# EAGLE schematic MySens-GWeasySensRS485-V01-009 (EAGLE 7.6.0)
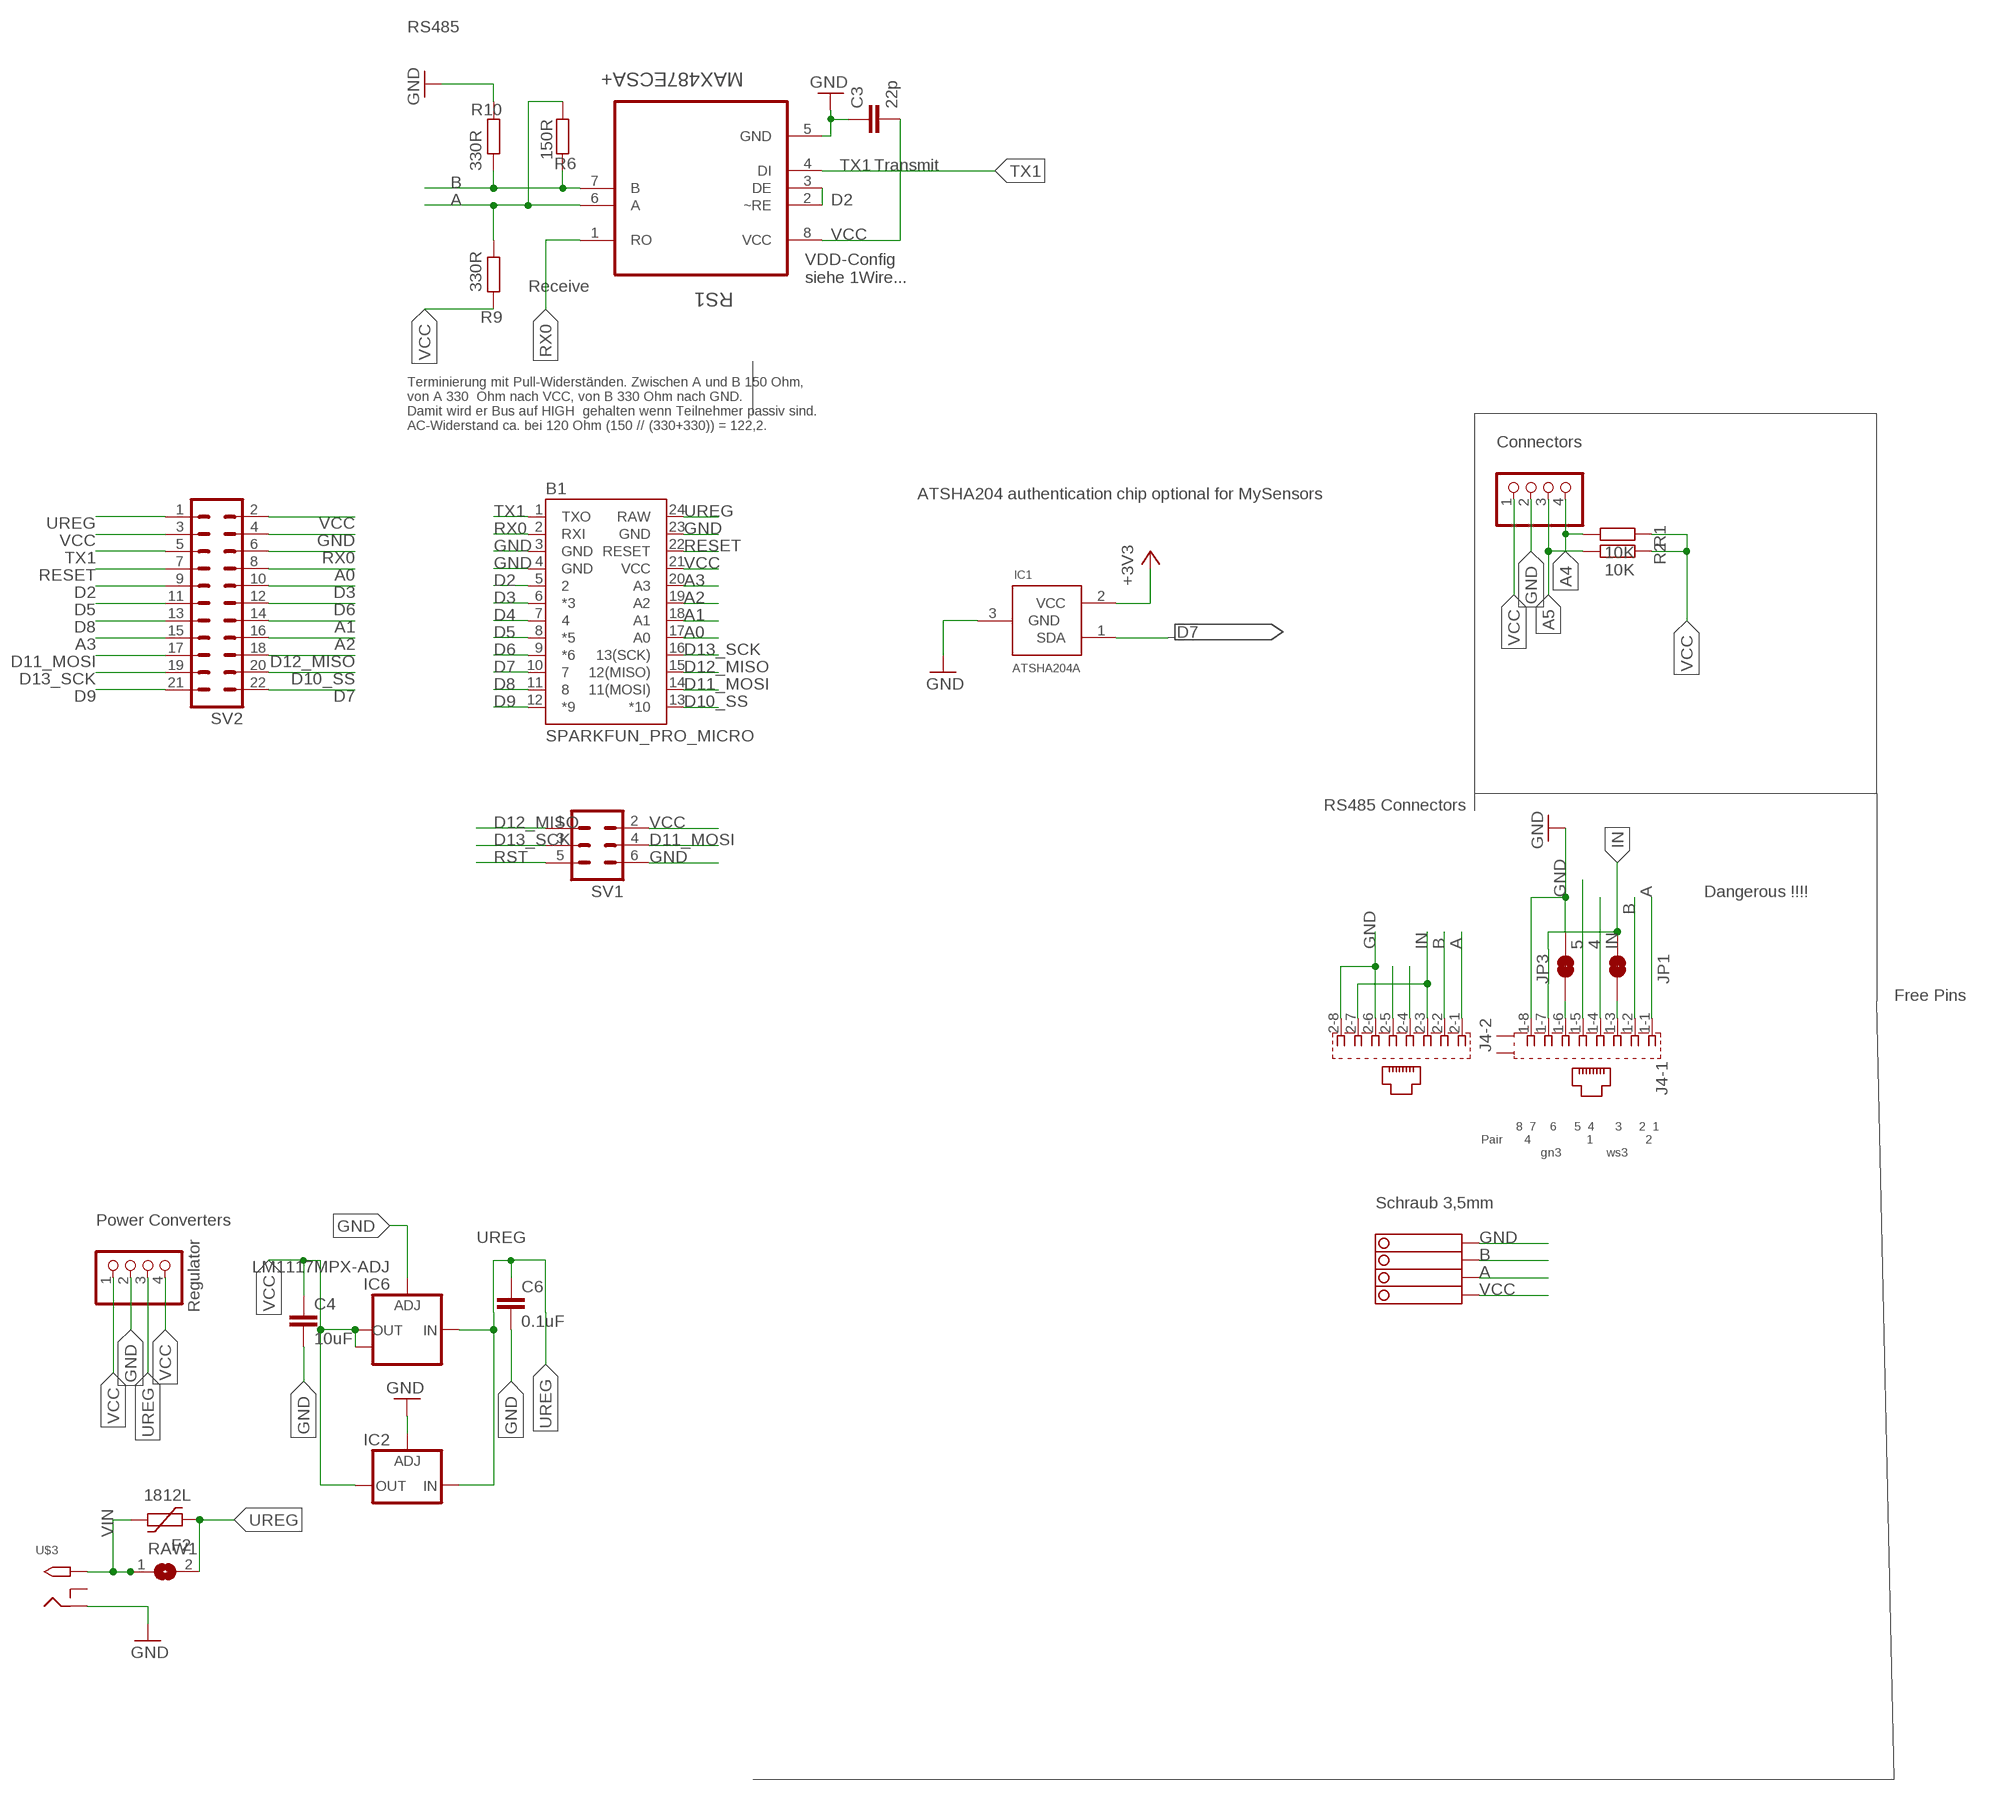
[diagram p0: schematic, sheet 1]

## Parts
B1  SPARKFUN_PRO_MICRO  [SPARKFUN_PRO_MICRO]
C3  22p  C-EUC0805  [C0805]
C4  10uF  C-EUC1210  [C1210]
C6  0.1uF  C-EUC1206  [C1206]
F2  1812L  [1812L]
IC1  ATSHA204A  [SOT23]
IC2  LD117ADT50TR  [DPACK]
IC6  LM1117MPX-ADJ  [SOT223]
J4  RJ45_2X_NARROW_SHILDPINS_NOCASE  [RJ45_2X_NARROW_SHILDPINS_NOCASE]
JP1  JUMPER-SMT_2_NC_TRACE_SILK  [SMT-JUMPER_2_NC_TRACE_SILK]
JP3  JUMPER-SMT_2_NC_TRACE_SILK  [SMT-JUMPER_2_NC_TRACE_SILK]
JP10  PINHD-1X04_2.54-S  [1X04-S]
R1  10K  R-EU_R0805  [R0805]
R2  10K  R-EU_R0805  [R0805]
R6  150R  R-EU_R0805  [R0805]
R9  330R  R-EU_R0805  [R0805]
R10  330R  R-EU_R0805  [R0805]
RAW1  SJ  [SJ]
RS1  MAX487ECSA+  [SOIC127P600X175-8N]
STEPDWN  PINHD-1X04_2.54-S  [1X04-S]
SV1  MA03-2  [MA03-2]
SV2  MA11-2  [MA11-2]
U$3  2.1MMJACKTHM  [PJ-102A]
X4  1751264  [1751264]

## Nets
1: J4.1-3 JP1.1
2: J4.1-6 JP3.1
3V3: IC1.2(VCC) ; supply symbol labelled +3V3
4: J4.1-4
5: J4.1-5
A: J4.1-1 J4.2-1 R6.1 R9.2 RS1.6(A) X4.2
A0: B1.17(A0) SV2.8
A1: B1.18(A1) SV2.14
A2: B1.19(A2) SV2.16
A3: B1.20(A3) SV2.15
A4: JP10.4 R1.2
A5: JP10.3 R2.2
B: J4.1-2 J4.2-2 R6.2 R10.1 RS1.7(B) X4.3
D2: B1.5 RS1.2(~RE) RS1.3(DE) SV2.9
D3: B1.6(*3) SV2.10
D4: B1.7
D5: B1.8(*5) SV2.11
D6: B1.9(*6) SV2.12
D7: B1.10 IC1.1(SDA) SV2.22
D8: B1.11 SV2.13
D9: B1.12(*9) SV2.21
D10_SS: B1.13(*10) SV2.20
D11_MOSI: B1.14(11(MOSI)) SV1.4 SV2.17
D12_MISO: B1.15(12(MISO)) SV1.1 SV2.18
D13_SCK: B1.16(13(SCK)) SV1.3 SV2.19
GND [Power]: B1.3(GND) B1.4(GND) B1.23(GND) C3.1 C4.2 C6.2 IC1.3(GND) IC2.1(ADJ) IC6.1(ADJ) J4.1-8 J4.2-6 J4.2-8 JP3.2 JP10.2 R10.2 RS1.5(GND) STEPDWN.2 SV1.6 SV2.4 U$3.RING X4.4
IN [Power]: J4.1-7 J4.2-3 J4.2-7 JP1.2
N$2: J4.2-4
N$3: J4.2-5
RESET: B1.22(RESET) SV2.7
RST: SV1.5
RX0: B1.2(RXI) RS1.1(RO) SV2.6
TX1: B1.1(TXO) RS1.4(DI) SV2.5
UREG [Power]: B1.24(RAW) C6.1 F2.P$1 IC2.3(IN) IC6.3(IN) RAW1.2 STEPDWN.3 SV2.1
VCC [Power]: B1.21(VCC) C3.2 C4.1 IC2.4(OUT) IC6.2(OUT) IC6.TAB(OUT1) JP10.1 R1.1 R2.1 R9.1 RS1.8(VCC) STEPDWN.1 STEPDWN.4 SV1.2 SV2.2 SV2.3 X4.1
VIN [Power]: F2.P$2 RAW1.1 U$3.TIP
Unconnected: J4.G1(-1:S1) J4.G3(-1:S2) U$3.RING_SW

## Notes on the sheet
- RS485
- Transmit
- VDD-Config
  siehe 1Wire...
- Receive
- Terminierung mit Pull-Widerständen. Zwischen A und B 150 Ohm,
  von A 330  Ohm nach VCC, von B 330 Ohm nach GND. 
  Damit wird er Bus auf HIGH  gehalten wenn Teilnehmer passiv sind.
  AC-Widerstand ca. bei 120 Ohm (150 // (330+330)) = 122,2.
- Connectors
- ATSHA204 authentication chip optional for MySensors
- RS485 Connectors
- Dangerous !!!!
- Free Pins
- 8  7    6     5  4      3     2  1
  Pair      4                1               2
                   gn3             ws3
- Schraub 3,5mm
- Power Converters
- Regulator

## Library data of the parts
B1 = SparkFun-Boards:SPARKFUN_PRO_MICRO: SparkFun Pro Micro Atmega32U4 compatible footprint. SparkFun Products: 3.3V/8MHz <https://www.sparkfun.com/products/12587> 5V/16MHz <https://www.sparkfun.com/products/12640>
C3 C4 C6 = rcl:C-EU: CAPACITOR, European symbol
F2 = ptc-littlefuse:1812L
IC1 = Sensor:ATSHA204A
IC2 = v-reg:LD117A?*: Low drop fixed and adjustable positive voltage regulators 1 A Source: http://www.st.com/stonline/products/literature/ds/7194/ld1117axx.pdf
IC6 = lm1117:LM1117MPX-ADJ
J4 = RJ45:RJ45_2X_NARROW_SHILDPINS_NOCASE: RJ45 connector
JP1 JP3 = SparkFun-Jumpers:JUMPER-SMT_2_NC_TRACE: Normally closed trace jumper This jumper has a trace between two pads so it's normally closed (NC). Use a razor knife to open the connection. For best results follow the IPC guidelines for cutting traces: Cutout at least 0.063 mm (0.005 in). Remove all loose material to clean up the cut area. Seal the cut with an approved epoxy. Reapply solder to reclose the connection.
JP10 STEPDWN = pinhead-2:PINHD-1X04: PIN HEADER
R1 R2 R6 R9 R10 = rcl:R-EU_: RESISTOR, European symbol
RAW1 = jumper:SJ: SMD solder JUMPER
RS1 = Maxim_By_element14_Batch_1:MAX487ECSA+: Low-Power, Slew-Rate-Limited RS-485/RS-422 Transceivers; MPN: MAX487ECSA+; OC_FARNELL: 9724532; OC_NEWARK: 68K4803; PACKAGE: SOIC-8; SUPPLIER: Maxim
SV1 = con-lstb:MA03-2: PIN HEADER; OC_FARNELL: unknown; OC_NEWARK: unknown
SV2 = con-Pinheader:MA11-2: PIN HEADER; OC_FARNELL: unknown; OC_NEWARK: unknown
U$3 = adafruit:2.1MMJACK: 2.1mm x 5.5mm THM DC jack with internal switch. Digikey part #PJ-102A, 4UCON part #05537 2.1mm x 5.5mm SMT DC jack with internal switch. Digikey part #PJ-002A-SMT, 4UCON part #03267 By microbuilder.eu & adafruit.com
X4 = con-phoenix-350:1751264: MKDS 1/ 4-3,5 Printklemme Nennstrom: 10 A Bemessungsspannung: 160 V Raster: 3,5 mm Polzahl: 4 Montageart: Löten Anschlussart: Schraubanschluss Anschlussrichtung vom Leiter zur Platine: 0° Source: http://eshop.phoenixcontact.com .. 1751264.pdf; MPN: 1751264; OC_FARNELL: unknown; OC_NEWARK: 10R0934

## Net classes
0 default: width 0.254 mm
1 Power: width 0.508 mm